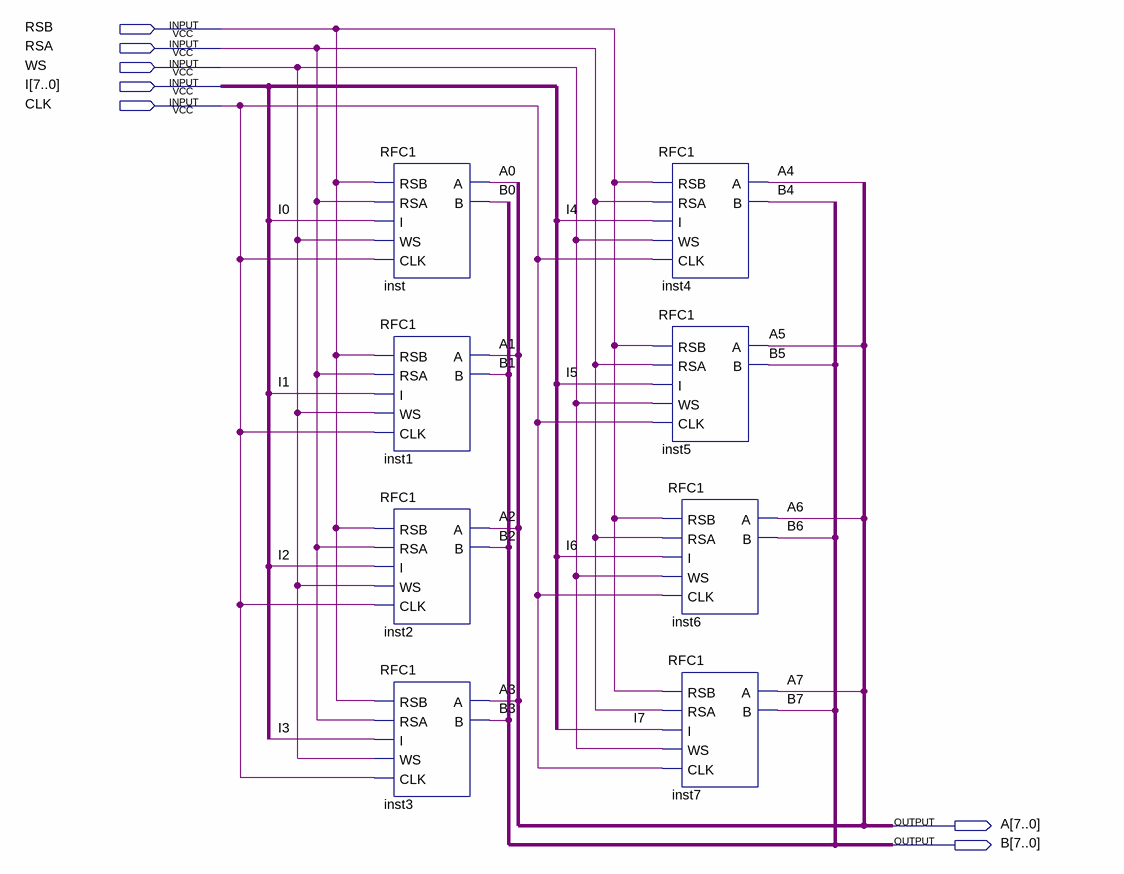
[diagram p0: schematic sheet]
// Quartus schematic RF8.bdf as structural Verilog: 8 symbols, 7 pins
module RF8 (
  input  RSB,
  input  RSA,
  input  WS,
  input  [7:0] I,
  input  CLK,
  output [7:0] A,
  output [7:0] B
);

  RFC1 inst (.RSB(RSB), .RSA(RSA), .I(I[0]), .WS(WS), .CLK(CLK), .A(A[0]), .B(B[0]));
  RFC1 inst1 (.RSB(RSB), .RSA(RSA), .I(I[1]), .WS(WS), .CLK(CLK), .A(A[1]), .B(B[1]));
  RFC1 inst2 (.RSB(RSB), .RSA(RSA), .I(I[2]), .WS(WS), .CLK(CLK), .A(A[2]), .B(B[2]));
  RFC1 inst3 (.RSB(RSB), .RSA(RSA), .I(I[3]), .WS(WS), .CLK(CLK), .A(A[3]), .B(B[3]));
  RFC1 inst4 (.RSB(RSB), .RSA(RSA), .I(I[4]), .WS(WS), .CLK(CLK), .A(A[4]), .B(B[4]));
  RFC1 inst5 (.RSB(RSB), .RSA(RSA), .I(I[5]), .WS(WS), .CLK(CLK), .A(A[5]), .B(B[5]));
  RFC1 inst6 (.RSB(RSB), .RSA(RSA), .I(I[6]), .WS(WS), .CLK(CLK), .A(A[6]), .B(B[6]));
  RFC1 inst7 (.RSB(RSB), .RSA(RSA), .I(I[7]), .WS(WS), .CLK(CLK), .A(A[7]), .B(B[7]));
endmodule
